# Altium schematic sheet Sheet1.SchDoc
size A4
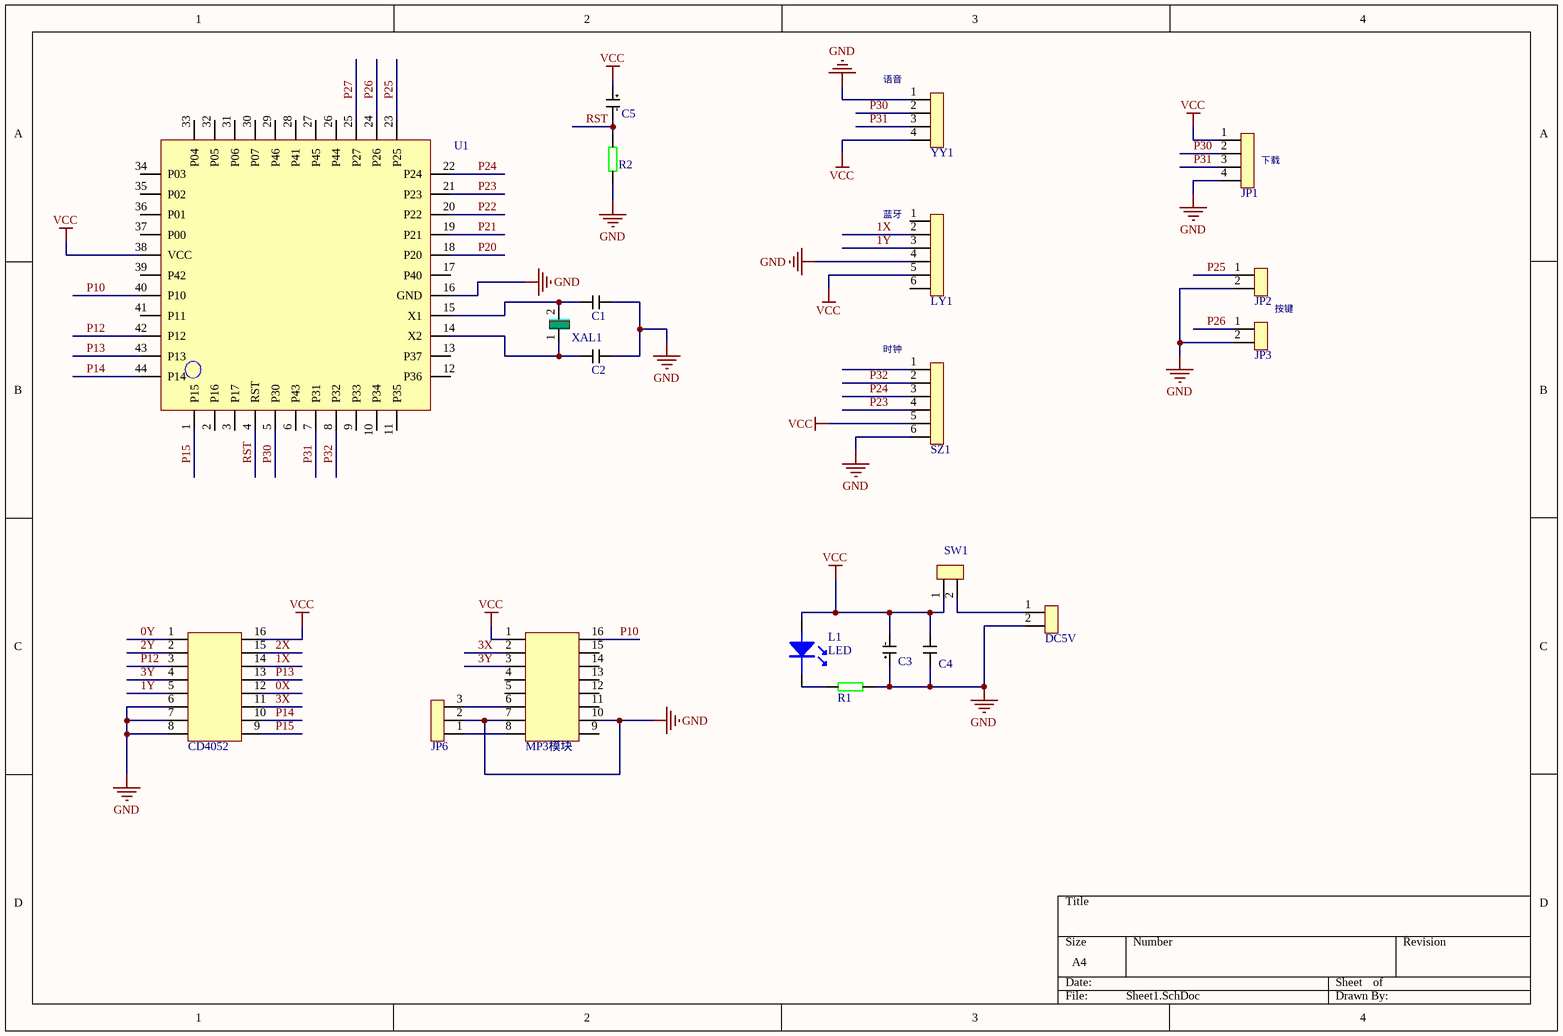
[diagram p0: Sheet1.SchDoc]

## Parts
C1  CAP  [0805]  (value not drawn)
C2  CAP  [0805]  (value not drawn)
C3  CAP+  [CAP-100mil]  (value not drawn)
C4  CAP  [CAP-100mil]  (value not drawn)
C5  CAP+  [CAP-100mil]  (value not drawn)
DC5V  SIP-2  [SIP-2]  (value not drawn)
JP1  SIP-4  [SIP-4]  (value not drawn)
JP2  SIP-2  [RES-200mil]  (value not drawn)
JP3  SIP-2  [RES-200mil]  (value not drawn)
JP6  SIP-3  [SIP-3]  (value not drawn)
L1  LED  [LED]
LY1  SIP-6  [SIP-6]  (value not drawn)
R1  RES  [RES-300mil]  (value not drawn)
R2  RES  [RES-300mil]  (value not drawn)
SW1  SIP-2  [RES-200mil]  (value not drawn)
SZ1  SIP-6  [SIP-6]  (value not drawn)
U1  STC89C52RC  [LQFP-44]  (value not drawn)
U2  CD4052  [SO-16]
U3  MP3模块  [DIP-16-660mil]
XAL1  晶振  [晶振-200mil]  (value not drawn)
YY1  SIP-4  [SIP-4]  (value not drawn)

## Nets
GND: C1.2 C2.2 C3.1 C4.2 DC5V.2 JP1.4 JP2.2 JP3.2 JP6.2 LY1.4 R1.2 R2.2 SZ1.6 U1.16(GND) U2.6 U2.7 U2.8 U3.7 U3.10 YY1.1
VCC: C3.2 C4.1 C5.1 JP1.1 L1.1 LY1.5 SW1.1 SZ1.5 U1.38(VCC) U2.16 U3.1 YY1.4
0X: U2.12
0Y: U2.1
1X: LY1.2 U2.14
1Y: LY1.3 U2.5
2X: U2.15
2Y: U2.2
3X: U2.11 U3.2
3Y: U2.4 U3.3
P10: U1.40(P10) U3.16
P12: U1.42(P12) U2.3
P13: U1.43(P13) U2.13
P14: U1.44(P14) U2.10
P15: U1.1(P15) U2.9
P20: U1.18(P20)
P21: U1.19(P21)
P22: U1.20(P22)
P23: SZ1.4 U1.21(P23)
P24: SZ1.3 U1.22(P24)
P25: JP2.1 U1.23(P25)
P26: JP3.1 U1.24(P26)
P27: U1.25(P27)
P30: JP1.2 U1.5(P30) YY1.2
P31: JP1.3 U1.7(P31) YY1.3
P32: SZ1.2 U1.8(P32)
RST: C5.2 R2.1 U1.4(RST)
NetC1_1: C1.1 U1.15(X1) XAL1.2
NetC2_1: C2.1 U1.14(X2) XAL1.1
NetDC5V_1: DC5V.1 SW1.2
NetJP6_1: JP6.1 U3.8
NetJP6_3: JP6.3 U3.6
NetL1_2: L1.2 R1.1

Not connected (* = marked no-connect by the designer): LY1 1 6; SZ1 1; U1 2(P16) 3(P17) 6(P43) 9(P33) 10(P34) 11(P35) 12(P36) 13(P37) 17(P40) 26(P44) 27(P45) 28(P41) 29(P46) 30(P07) 31(P06) 32(P05) 33(P04) 34(P03) 35(P02) 36(P01) 37(P00) 39(P42) 41(P11); U3 4 5 9 11 12 13 14 15

## Notes on the sheet
- (near YY1) 语音
- (near JP1) 下载
- (near LY1) 蓝牙
- 按键
- (near SZ1) 时钟

## Library data of the parts
U2 = DIP-16: pin to pad: 1>16 2>15 3>14 4>13 5>12 6>11 7>10 8>9 9>8 10>7 11>6 12>5 13>4 14>3 15>2 16>1
U3 = DIP-16